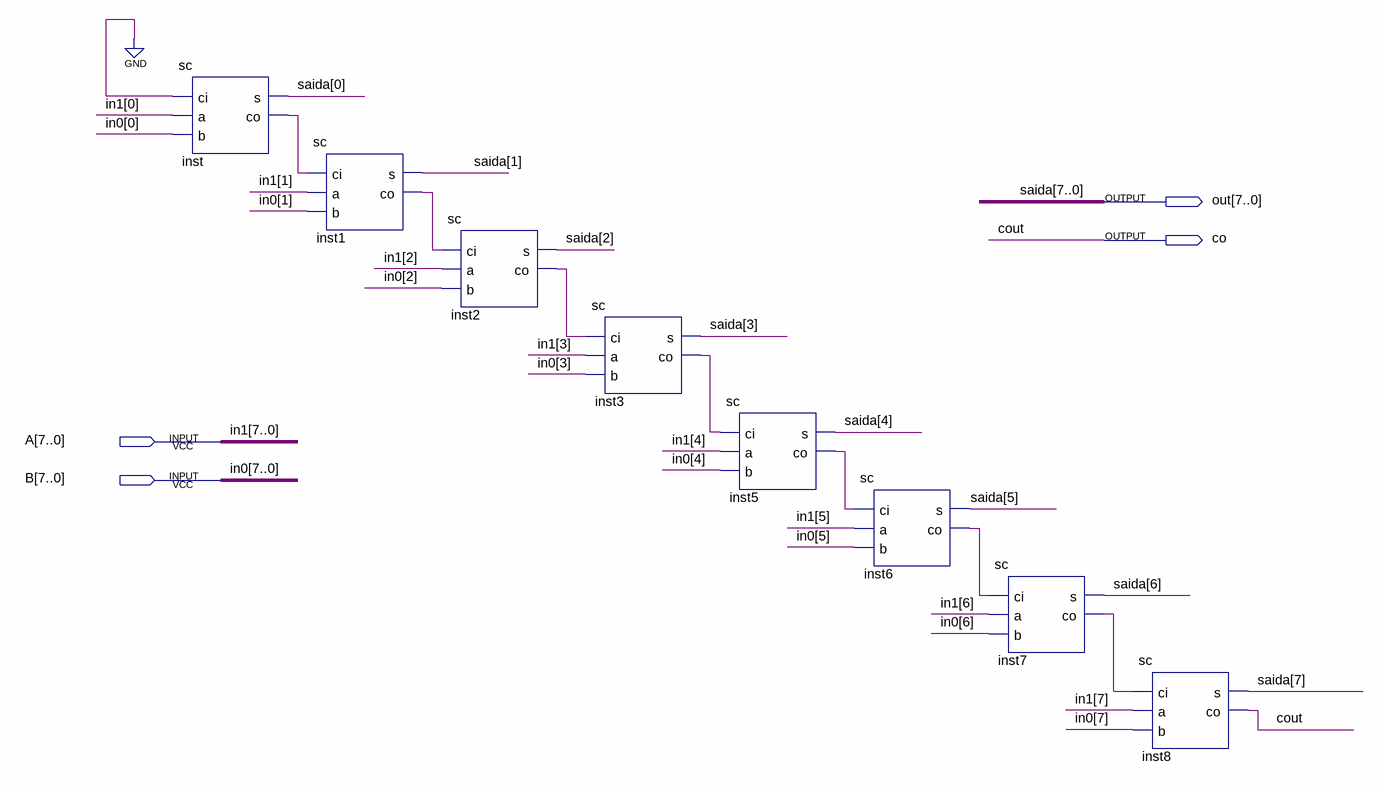
[diagram p0: schematic sheet]
// Quartus schematic add.bdf as structural Verilog: 8 symbols, 4 pins
module add (
  input  [7:0] A,
  input  [7:0] B,
  output [7:0] out,
  output co
);

  wire inst1_co, inst2_co, inst3_co, inst5_co, inst6_co, inst7_co, inst_co;

  sc inst (.ci(1'b0), .a(A[0]), .b(B[0]), .s(out[0]), .co(inst_co));
  sc inst1 (.ci(inst_co), .a(A[1]), .b(B[1]), .s(out[1]), .co(inst1_co));
  sc inst2 (.ci(inst1_co), .a(A[2]), .b(B[2]), .s(out[2]), .co(inst2_co));
  sc inst3 (.ci(inst2_co), .a(A[3]), .b(B[3]), .s(out[3]), .co(inst3_co));
  sc inst5 (.ci(inst3_co), .a(A[4]), .b(B[4]), .s(out[4]), .co(inst5_co));
  sc inst6 (.ci(inst5_co), .a(A[5]), .b(B[5]), .s(out[5]), .co(inst6_co));
  sc inst7 (.ci(inst6_co), .a(A[6]), .b(B[6]), .s(out[6]), .co(inst7_co));
  sc inst8 (.ci(inst7_co), .a(A[7]), .b(B[7]), .s(out[7]), .co(co));

  // Other names for the same wires on the sheet: cout = co; in0[7:0] = B; in1[7:0] = A; saida[7:0] = out
endmodule
